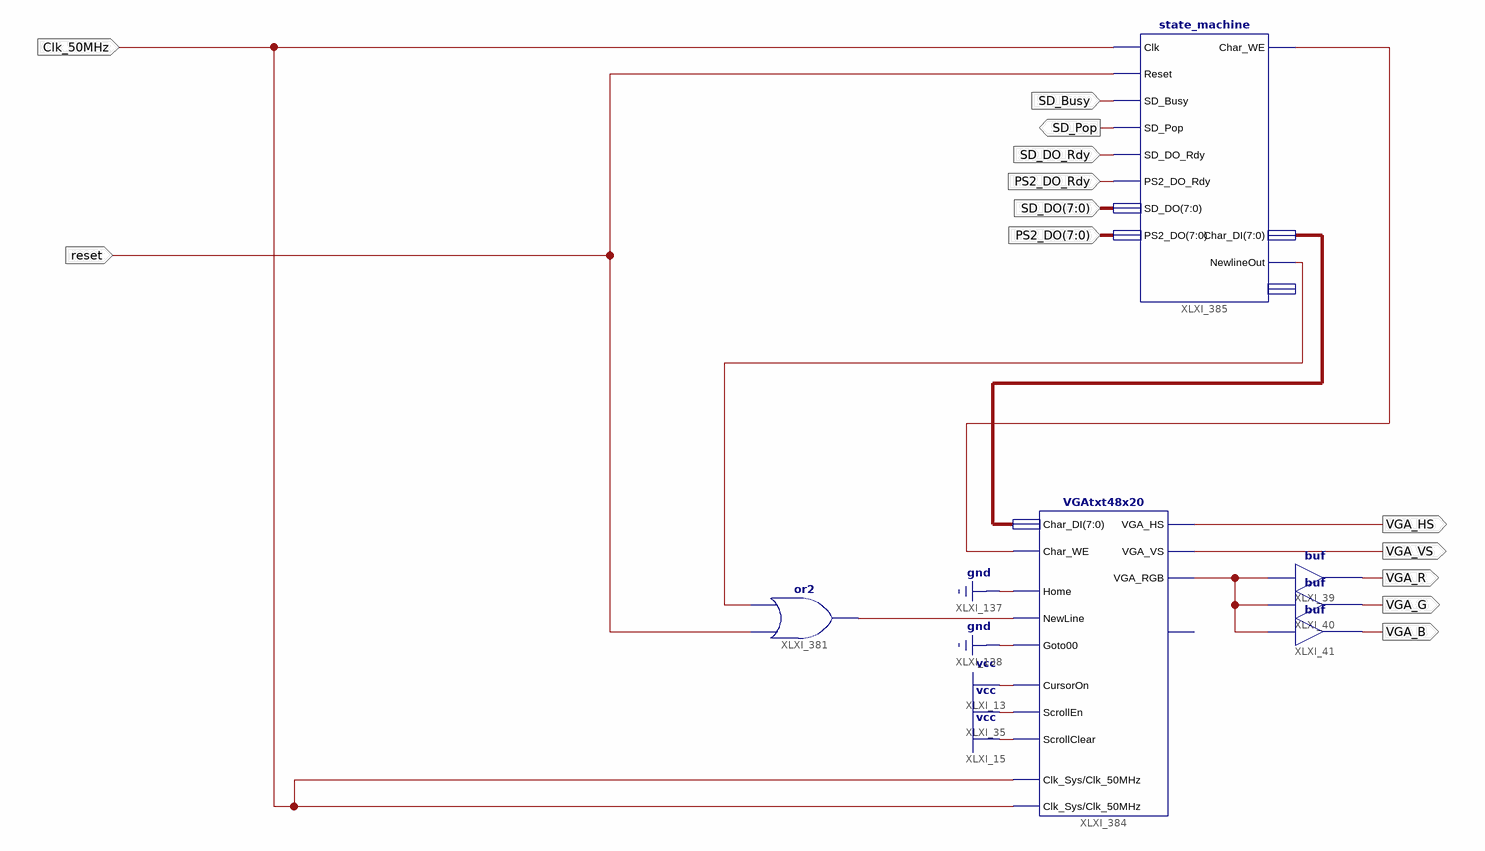
[diagram p0: schematic sheet 1]
// Xilinx ISE schematic simulation_sm_vgascan.sch (spartan3e) as structural Verilog: 6 symbols, 13 ports
module simulation_sm_vgascan (
  input  reset,
  input  Clk_50MHz,
  input  SD_Busy,
  input  SD_DO_Rdy,
  input  PS2_DO_Rdy,
  input  [7:0] SD_DO,
  input  [7:0] PS2_DO,
  output VGA_VS,
  output VGA_HS,
  output VGA_G,
  output VGA_B,
  output VGA_R,
  output SD_Pop
);

  wire XLXN_564, XLXN_1178, XLXN_1192, XLXN_1195;
  wire [7:0] XLXN_1179;

  buf XLXI_39 (VGA_R, XLXN_564);
  buf XLXI_40 (VGA_G, XLXN_564);
  buf XLXI_41 (VGA_B, XLXN_564);
  or XLXI_381 (XLXN_1195, reset, XLXN_1192);
  VGAtxt48x20 XLXI_384 (
    .Char_DI(XLXN_1179), .Home(1'b0), .NewLine(XLXN_1195), .Goto00(1'b0), .Clk_Sys(Clk_50MHz),
    .Clk_50MHz(Clk_50MHz), .CursorOn(1'b1), .ScrollEn(1'b1), .ScrollClear(1'b1), .VGA_HS(VGA_HS),
    .VGA_VS(VGA_VS), .VGA_RGB(XLXN_564), .Char_WE(XLXN_1178));  // open: Busy
  state_machine XLXI_385 (
    .Clk(Clk_50MHz), .Reset(reset), .SD_Busy(SD_Busy), .SD_DO_Rdy(SD_DO_Rdy), .PS2_DO_Rdy(PS2_DO_Rdy),
    .SD_DO(SD_DO), .PS2_DO(PS2_DO), .Char_WE(XLXN_1178), .NewlineOut(XLXN_1192), .SD_Pop(SD_Pop),
    .Char_DI(XLXN_1179));  // open: Score_DI
endmodule
